# Altium schematic sheet Sheet1.SchDoc
size A3; SheetNumber: 1; SheetTotal: 4
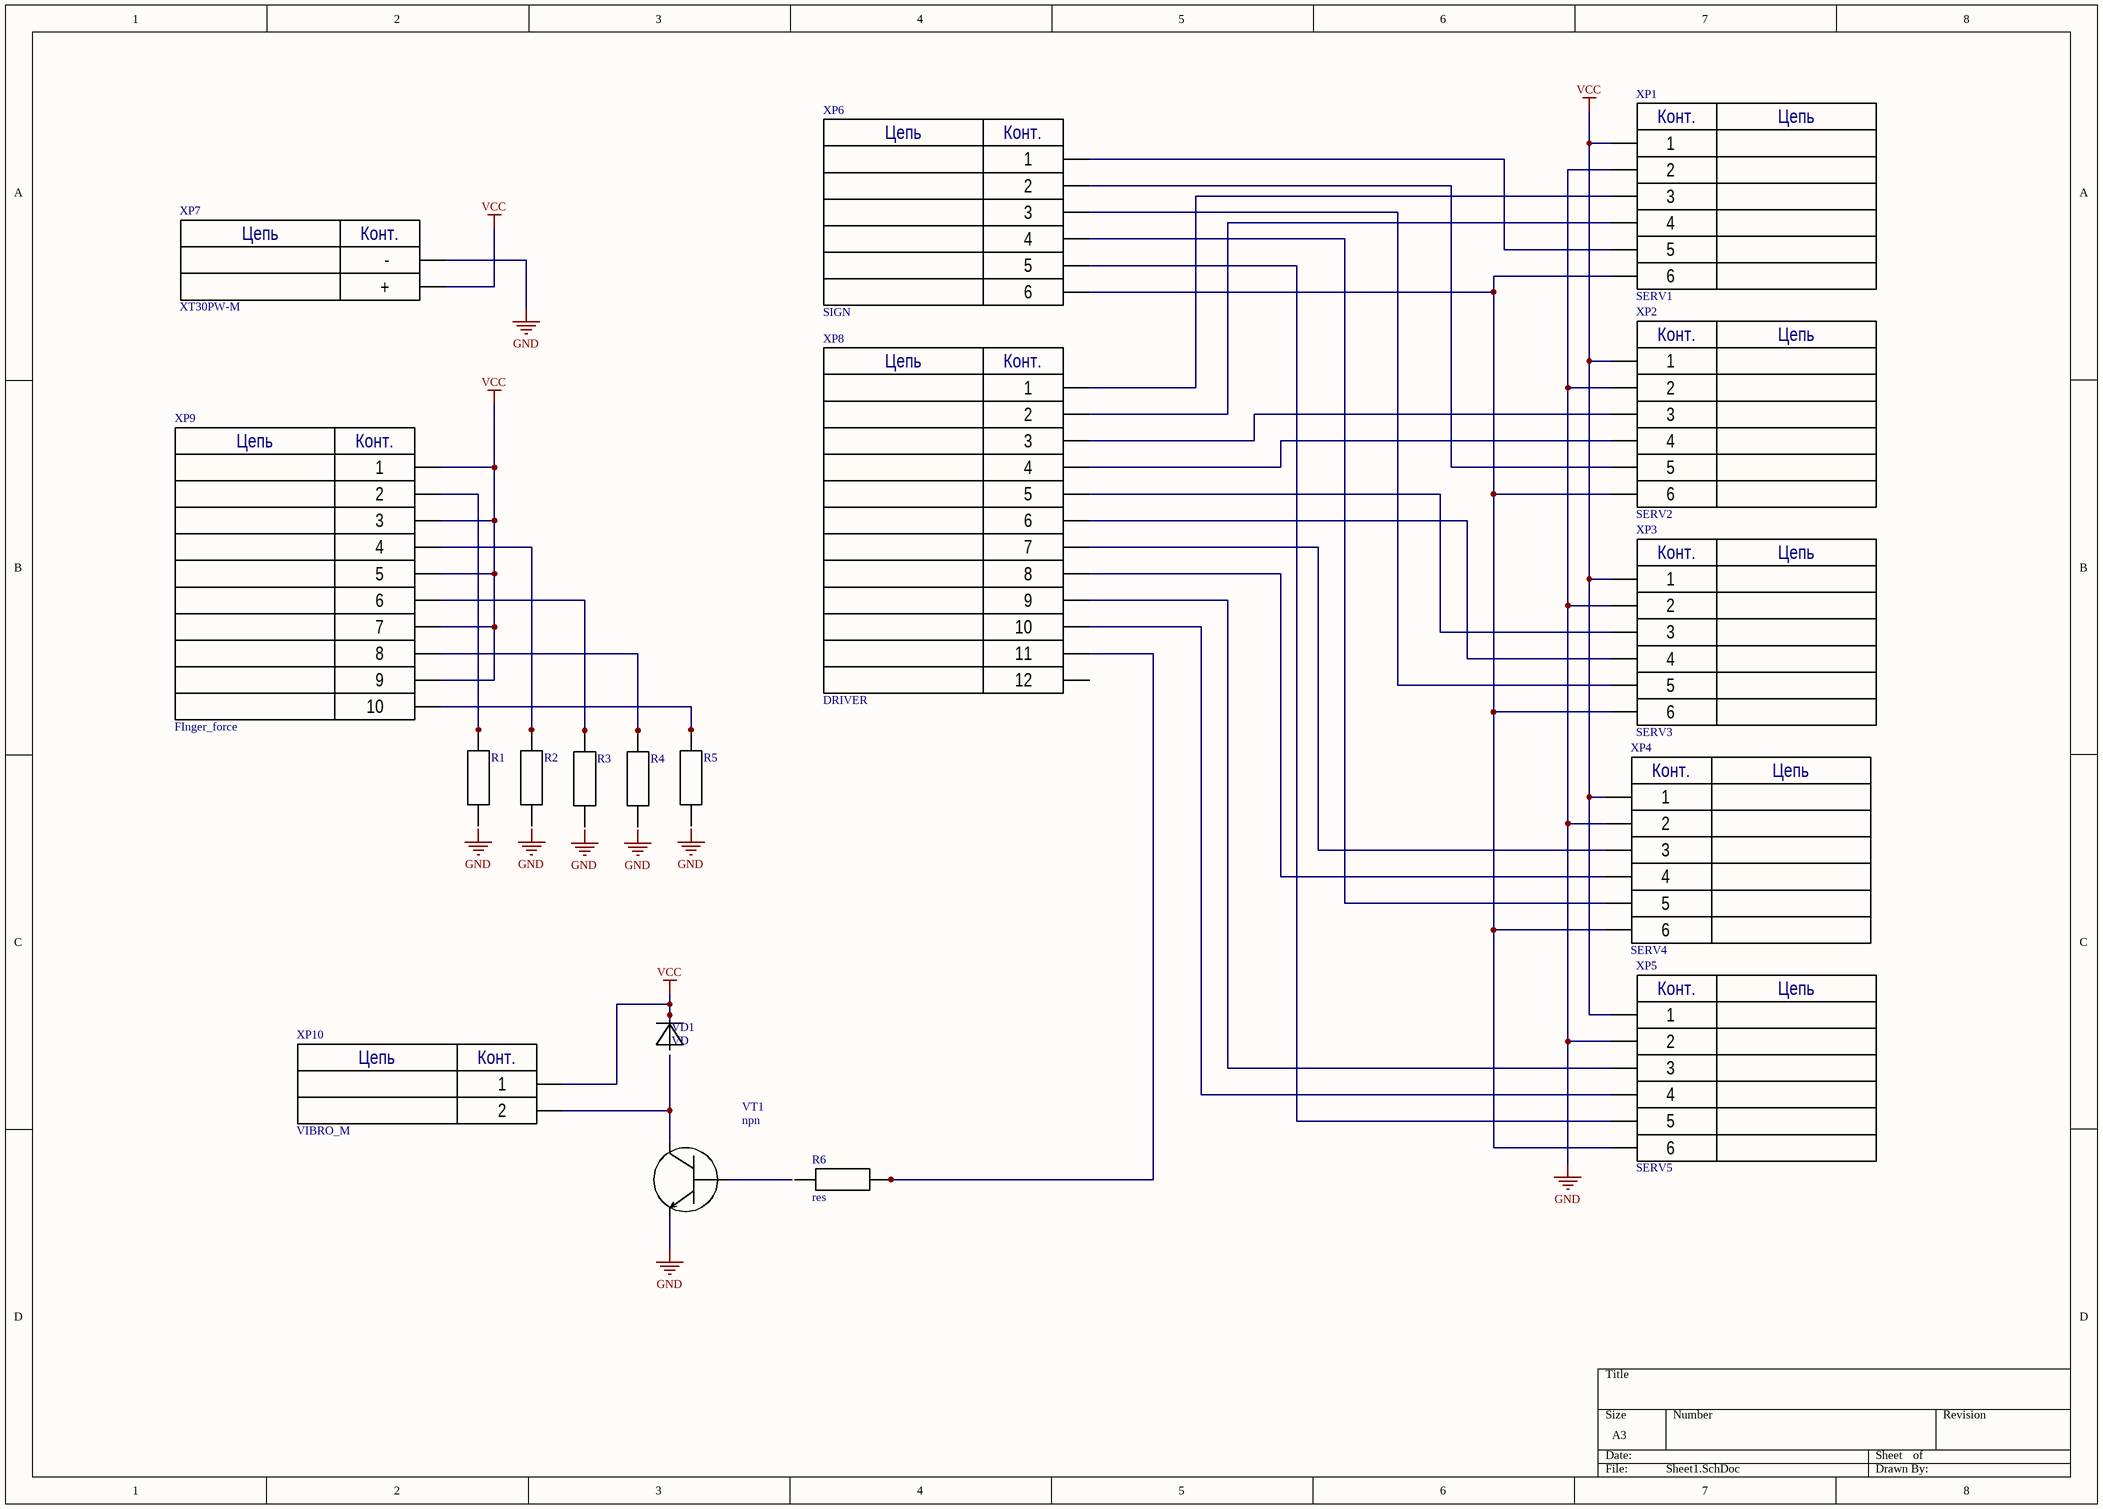
[diagram p0: Sheet1.SchDoc]

## Parts
R1  res  [RES]  (value not drawn)
R2  res  [RES]  (value not drawn)
R3  res  [RES]  (value not drawn)
R4  res  [RES]  (value not drawn)
R5  res  [RES]  (value not drawn)
R6  res  [RES]
VD1  VD  [DIODE]
VT1  npn  [TO-92]
XP1  SERV1  [PLS-6]
XP2  SERV2  [PLS-6]
XP3  SERV3  [PLS-6]
XP4  SERV4  [PLS-6]
XP5  SERV5  [PLS-6]
XP6  SIGN  [PLS-6]
XP7  XT30PW-M  [XT30U-F]
XP8  DRIVER  [PLD-12]
XP9  FInger_force  [PLD-10]
XP10  VIBRO_M  [PLS-2]

## Nets
GND: VT1.3 XP1.2 XP2.2 XP3.2 XP4.2 XP5.2 XP7.1(-)
VCC: VD1.2 XP1.1 XP2.1 XP3.1 XP4.1 XP5.1 XP7.2(+) XP9.1 XP9.3 XP9.5 XP9.7 XP9.9 XP10.1
NetR1_2: R1.2 XP9.2
NetR2_2: R2.2 XP9.4
NetR3_2: R3.2 XP9.6
NetR4_2: R4.2 XP9.8
NetR5_2: R5.2 XP9.10
NetR6_2: R6.2 XP8.11
NetVT1_1: VT1.1 XP10.2
NetXP1_3: XP1.3 XP8.1
NetXP1_4: XP1.4 XP8.2
NetXP1_5: XP1.5 XP6.1
NetXP1_6: XP1.6 XP2.6 XP3.6 XP4.6 XP5.6 XP6.6
NetXP2_3: XP2.3 XP8.3
NetXP2_4: XP2.4 XP8.4
NetXP2_5: XP2.5 XP6.2
NetXP3_3: XP3.3 XP8.5
NetXP3_4: XP3.4 XP8.6
NetXP3_5: XP3.5 XP6.3
NetXP4_3: XP4.3 XP8.7
NetXP4_4: XP4.4 XP8.8
NetXP4_5: XP4.5 XP6.4
NetXP5_3: XP5.3 XP8.9
NetXP5_4: XP5.4 XP8.10
NetXP5_5: XP5.5 XP6.5

Not connected (* = marked no-connect by the designer): R1 1(5); R2 1(5); R3 1(5); R4 1(5); R5 1(5); R6 1(5); VD1 1; VT1 2(13); XP8 12

## Notes on the sheet
- Labels drawn without touching a wire or pin: GND
- (in symbol PLD-10) Цепь; Конт.
- (in symbol PLD-12) Цепь; Конт.
- (in symbol PLS-2) Цепь; Конт.
- (in symbol PLS-6) Конт.; Цепь
- (in symbol XT30PW-M) Цепь; Конт.

## Library data of the parts
XP1-XP6 = PLS-6
XP8 = PLD-12
XP9 = PLD-10
XP10 = PLS-2